# Altium schematic sheet Channel.SchDoc
size A4
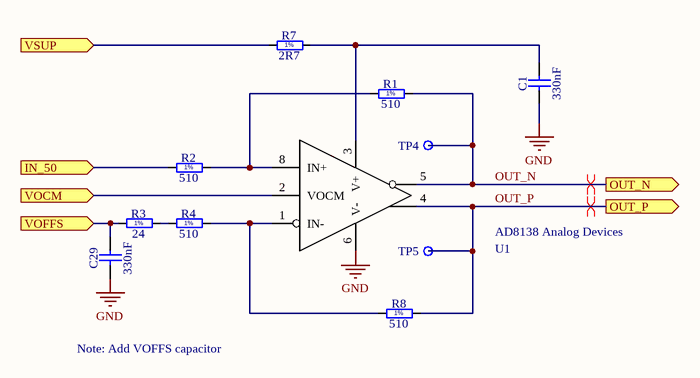
[diagram p0: Channel.SchDoc]

## Parts
C1  330nF  [CAPC2012X135N]
C29  330nF  [CAPC2012X135N]
R1  510  [RESC2012X60N]
R2  510  [RESC2012X60N]
R3  24  [RESC2012X60N]
R4  510  [RESC2012X60N]
R7  2R7  [RESC2012X60N]
R8  510  [RESC2012X60N]
TP4  Test Point  [Testpoint]  (value not drawn)
TP5  Test Point  [Testpoint]  (value not drawn)
U1  AD8138 Analog Devices  [SOIC127P600X175-8N]

## Ports
IN_50 (in), OUT_N (out), OUT_P (out), VOCM (in), VOFFS (in), VSUP (in)

## Nets
GND: C1.1 C29.1 U1.6(V-)
IN_50: R2.1 ; port IN_50
OUT_N: R1.2 TP4.1 U1.5(OUT-) ; port OUT_N
OUT_P: R8.2 TP5.1 U1.4(OUT+) ; port OUT_P
VOCM: U1.2(VOCM) ; port VOCM
VOFFS: C29.2 R3.1 ; port VOFFS
VSUP: R7.1 ; port VSUP
NetC1_2: C1.2 R7.2 U1.3(V+)
NetR1_1: R1.1 R2.2 U1.8(IN+)
NetR3_2: R3.2 R4.1
NetR4_2: R4.2 R8.1 U1.1(IN-)

## Layout directives
differential pair: OUT_N, OUT_P

## Notes on the sheet
- Note: Add VOFFS capacitor
- (in symbol R0805_2R7_1%_0.125W_200PPM) 1%
- (in symbol R0805_24R_1%_0.125W_100PPM) 1%
- (in symbol R0805_510R_1%_0.125W_100PPM) 1%

## Library data of the parts
C1 C29 = CC0805_330NF_16V_10%_X7R: Non-polarised capacitor; Part Description: SMD Multilayer Chip Ceramic Capacitor; Manufacturer: GENERIC; Manufacturer1 Part Number: CC0805KKX7R7BB334; Voltage: 16V; TC: X7R; Tolerance: ±10%; Part Number: CC0805_330NF_16V_10%_X7R; Component Kind: Standard; Component Type: Standard; Pin Count: 2; Value: 330nF; Status: Preferred; Manufacturer Part Number: CC0805_330NF_16V_10%_X7R; Case: 0805; Mounted: Yes; Socket: No; SMD: Yes; Sense: No; Manufacturer1 Example: YAGEO; Manufacturer1 ComponentHeight: 1.45mm; HelpURL: \\cern.ch\dfs\Applications\Altium\Datasheets\CC0805_X7R_YAGEO_HIGH CAPACITANCE_MAX50V.pdf; Author: CERN DEM JLC; CreateDate: 03.12.2007; LatestRevisionDate: 21.04.2015
R1 R2 R4 R8 = R0805_510R_1%_0.125W_100PPM: Resistor - 1%; Part Description: General Purpose Thick Film Chip Resistor; Manufacturer: GENERIC; Manufacturer1 Part Number: NRC10F5100TRF; Power: 0.125W; TC: ±100ppm/°C; PressFit: No; Part Number: R0805_510R_1%_0.125W_100PPM; Component Kind: Standard; Component Type: Standard; Pin Count: 2; Value: 510; Status: Preferred; Tolerance: ±1%; Manufacturer Part Number: R0805_510R_1%_0.125W_100PPM; Case: 0805; Mounted: Yes; Sense: No; Socket: No; SMD: Yes; Manufacturer1 Example: NIC COMPONENT; Manufacturer1 ComponentHeight: 0.6mm; HelpURL: \\cern.ch\dfs\Applications\Altium\Datasheets\R0805_NIC_NRC.pdf; Author: CERN DEM JLC; CreateDate: 03.12.2007; LatestRevisionDate: 13.03.2008
R3 = R0805_24R_1%_0.125W_100PPM: Resistor - 1%; Part Description: General Purpose Thick Film Chip Resistor; Manufacturer: GENERIC; Manufacturer1 Part Number: NRC10F24R0TRF; Power: 0.125W; TC: ±100ppm/°C; PressFit: No; Part Number: R0805_24R_1%_0.125W_100PPM; Component Kind: Standard; Component Type: Standard; Pin Count: 2; Value: 24; Status: Preferred; Tolerance: ±1%; Manufacturer Part Number: R0805_24R_1%_0.125W_100PPM; Case: 0805; Mounted: Yes; Sense: No; Socket: No; SMD: Yes; Manufacturer1 Example: NIC COMPONENT; Manufacturer1 ComponentHeight: 0.6mm; HelpURL: \\cern.ch\dfs\Applications\Altium\Datasheets\R0805_NIC_NRC.pdf; Author: CERN DEM JLC; CreateDate: 03.12.2007; LatestRevisionDate: 13.03.2008
R7 = R0805_2R7_1%_0.125W_200PPM: Resistor - 1%; Part Description: General Purpose Thick Film Chip Resistor; Manufacturer: GENERIC; Manufacturer1 Part Number: 232273462708L or RC0805FR-072R7L; Power: 0.125W; TC: ±200ppm/°C; PressFit: No; Part Number: R0805_2R7_1%_0.125W_200PPM; Component Kind: Standard; Component Type: Standard; Pin Count: 2; Value: 2R7; Status: Preferred; Tolerance: ±1%; Manufacturer Part Number: R0805_2R7_1%_0.125W_200PPM; Case: 0805; Mounted: Yes; Sense: No; Socket: No; SMD: Yes; Manufacturer1 Example: YAGEO PHYCOMP; Manufacturer1 ComponentHeight: 0.65mm; HelpURL: \\cern.ch\dfs\Applications\Altium\Datasheets\R0805_Phycomp_RC0805.pdf; Author: CERN DEM JLC; CreateDate: 03.12.2007; LatestRevisionDate: 17.10.2012
TP4 TP5 = VERO_20-313145: Part Description: Black Bead PCB Terminal Test Pin for 2.4mm PCB Thickness (1.32mm Hole); Manufacturer: VERO TECHNOLOGIES; PressFit: No; Part Number: VERO_20-313145; Component Kind: Standard; Component Type: Standard; Footprint: VERO_20-313145; Pin Count: 1; Family: Test Point; Mounted: Yes; Socket: No; SMD: No; Sense: No; Status: None; Manufacturer Part Number: 20-313145; ComponentHeight: 5.3mm; HelpURL: \\cern.ch\dfs\Applications\Altium\Datasheets\VERO_20-313145.pdf; Author: CERN DEM JLC; CreateDate: 15.07.2013; LatestRevisionDate: 15.07.2013
U1 = AD8138: Manufacturer: Analog Devices; Name: AD8138